# EAGLE design RFM2Pi_rev3 (EAGLE 6.2)
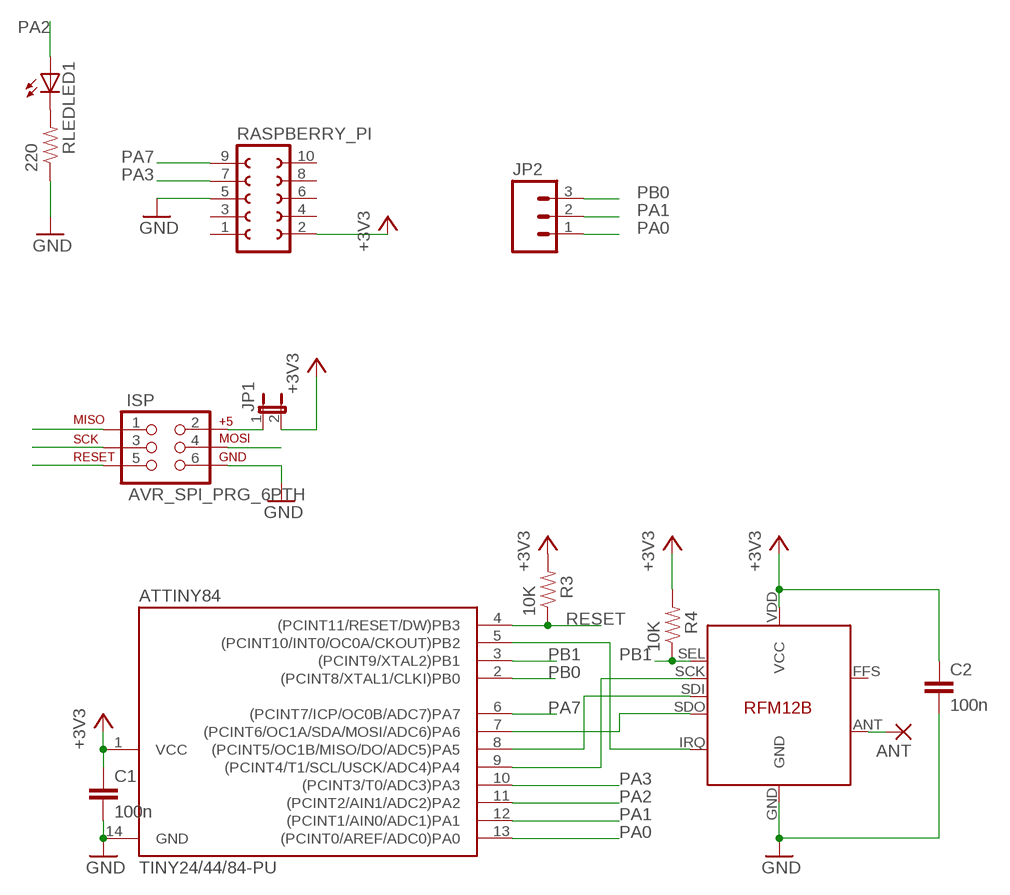
[diagram p0: schematic, sheet 1]

## Parts
ANT  1,6/0,8  [1,6/0,8]
ATTINY84  TINY24/44/84-PU  [DIL14]
C1  100n  C-EU025-024X044  [C025-024X044]
C2  100n  C-EU025-024X044  [C025-024X044]
ISP  AVR_SPI_PRG_6PTH  [2X3]
JP1  JUMPER-2PTH  [1X02]
JP2  M03LOCK  [1X03_LOCK]
LED1  LED5MM  [LED5MM]
R3  10K  RESISTORAXIAL-0.3  [AXIAL-0.3]
R4  10K  RESISTORAXIAL-0.3  [AXIAL-0.3]
RASPBERRY_PI  FE05-2  [FE05-2]
RFM12B  RFM12B  [RFM12B]
RLED  220  RESISTORAXIAL-0.3  [AXIAL-0.3]

## Nets
+3V3 [power]: ATTINY84.1(VCC) C1.1 C2.1 JP1.2 R3.P$2 R4.P$2 RASPBERRY_PI.2 RFM12B.VDD(VCC)
GND [power]: ATTINY84.14(GND) C1.2 C2.2 ISP.6 RASPBERRY_PI.5 RFM12B.GND RLED.P$1
MISO: ATTINY84.8((PCINT5/OC1B/MISO/DO/ADC5)PA5) ISP.1 RFM12B.SDI
MOSI: ATTINY84.7((PCINT6/OC1A/SDA/MOSI/ADC6)PA6) ISP.4 RFM12B.SDO
N$1: ISP.2 JP1.1
N$3: LED1.K(C) RLED.P$2
N$6 [power]: ANT.1(P) RFM12B.ANT
PA0: ATTINY84.13((PCINT0/AREF/ADC0)PA0) JP2.1
PA1 [power]: ATTINY84.12((PCINT1/AIN0/ADC1)PA1) JP2.2
PA2: ATTINY84.11((PCINT2/AIN1/ADC2)PA2) LED1.A
PA3: ATTINY84.10((PCINT3/T0/ADC3)PA3) RASPBERRY_PI.7
PA7: ATTINY84.6((PCINT7/ICP/OC0B/ADC7)PA7) RASPBERRY_PI.9
PB0: ATTINY84.2((PCINT8/XTAL1/CLKI)PB0) JP2.3
PB1: ATTINY84.3((PCINT9/XTAL2)PB1) R4.P$1 RFM12B.SEL
PB2: ATTINY84.5((PCINT10/INT0/OC0A/CKOUT)PB2) RFM12B.IRQ
RESET: ATTINY84.4((PCINT11/RESET/DW)PB3) ISP.5 R3.P$1
SCK: ATTINY84.9((PCINT4/T1/SCL/USCK/ADC4)PA4) ISP.3 RFM12B.SCK
Unconnected: RASPBERRY_PI.1 RASPBERRY_PI.3 RASPBERRY_PI.4 RASPBERRY_PI.6 RASPBERRY_PI.8 RASPBERRY_PI.10 RFM12B.FFS

## Library data of the parts
ANT = JeeLabs:1,6/0,8: THROUGH-HOLE PAD
ATTINY84 = avr-7:TINY24/44/84
C1 C2 = rcl:C-EU: CAPACITOR, European symbol
ISP = SparkFun:AVR_SPI_PRG_6: AVR ISP 6 Pin This is the reduced ISP connector for AVR programming. Common on Arduino. This footprint will take up less PCB space and can be used with a 10-pin to 6-pin adapter such as SKU: BOB-08508
JP1 = SparkFun:JUMPER-2: Jumper Basic 0.1" spaced jumper. Use with breakaway headers.
JP2 = SparkFun:M03: Header 3 Standard 3-pin 0.1" header. Use with straight break away headers (SKU : PRT-00116), right angle break away headers (PRT-00553), swiss pins (PRT-00743), machine pins (PRT-00117), and female headers (PRT-00115). Molex polarized connector foot print use with SKU : PRT-08232 with associated crimp pins and housings.
LED1 = led:LED: LED OSRAM: - CHIPLED LG R971, LG N971, LY N971, LG Q971, LY Q971, LO R971, LY R971 LH N974, LH R974 LS Q976, LO Q976, LY Q976 LO Q996 - Hyper CHIPLED LW Q18S LB Q993, LB Q99A, LB R99A - SideLED LS A670, LO A670, LY A670, LG A670, LP A670 LB A673, LV A673, LT A673, LW A673 LH A674 LY A675 LS A676, LA A676, LO A676, LY A676, LW A676 LS A679, LY A679, LG A679 - Hyper Micro SIDELED® LS Y876, LA Y876, LO Y876, LY Y876 LT Y87S - SmartLED LW L88C, LW L88S LB L89C, LB L89S, LG L890 LS L89K, LO L89K, LY L89K LS L896, LA L896, LO L896, LY L896 - TOPLED LS T670, LO T670, LY T670, LG T670, LP T670 LSG T670, LSP T670, LSY T670, LOP T670, LYG T670 LG T671, LOG T671, LSG T671 LB T673, LV T673, LT T673, LW T673 LH T674 LS T676, LA T676, LO T676, LY T676, LB T676, LH T676, LSB T676, LW T676 LB T67C, LV T67C, LT T67C, LS T67K, LO T67K, LY T67K, LW E67C LS E67B, LA E67B, LO E67B, LY E67B, LB E67C, LV E67C, LT E67C LW T67C LS T679, LY T679, LG T679 LS T770, LO T770, LY T770, LG T770, LP T770 LB T773, LV T773, LT T773, LW T773 LH T774 LS E675, LA E675, LY E675, LS T675 LS T776, LA T776, LO T776, LY T776, LB T776 LHGB T686 LT T68C, LB T68C - Hyper Mini TOPLED® LB M676 - Mini TOPLED Santana® LG M470 LS M47K, LO M47K, LY M47K Source: http://www.osram.convergy.de LUXEON: - LUMILED® LXK2-PW12-R00, LXK2-PW12-S00, LXK2-PW14-U00, LXK2-PW14-V00 LXK2-PM12-R00, LXK2-PM12-S00, LXK2-PM14-U00 LXK2-PE12-Q00, LXK2-PE12-R00, LXK2-PE12-S00, LXK2-PE14-T00, LXK2-PE14-U00 LXK2-PB12-K00, LXK2-PB12-L00, LXK2-PB12-M00, LXK2-PB14-N00, LXK2-PB14-P00, LXK2-PB14-Q00 LXK2-PR12-L00, LXK2-PR12-M00, LXK2-PR14-Q00, LXK2-PR14-R00 LXK2-PD12-Q00, LXK2-PD12-R00, LXK2-PD12-S00 LXK2-PH12-R00, LXK2-PH12-S00 LXK2-PL12-P00, LXK2-PL12-Q00, LXK2-PL12-R00 Source: www.luxeon.com KINGBRIGHT: KA-3528ASYC Source: www.kingbright.com
R3 R4 RLED = SparkFun:RESISTOR: Resistor Basic schematic elements and footprints for 0603, 1206, and PTH resistors.
RASPBERRY_PI = con-lsta:FE05-2: FEMALE HEADER; OC_FARNELL: unknown; OC_NEWARK: unknown
RFM12B = JeeLabs:RFM12B

## Net classes
0 default: width 0.254 mm, drill 0.254 mm, clearance 0.254 mm
1 power: width 0.305 mm, drill 0.305 mm, clearance 0.305 mm

## Board
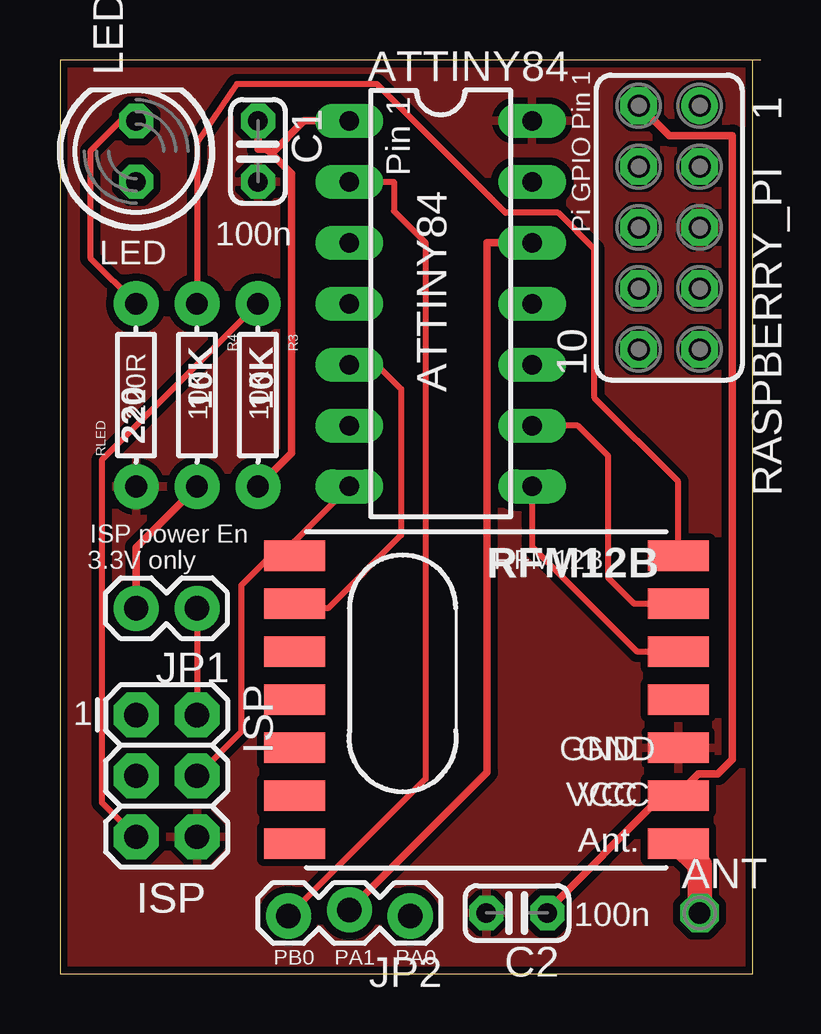
[diagram p1: board, top side]
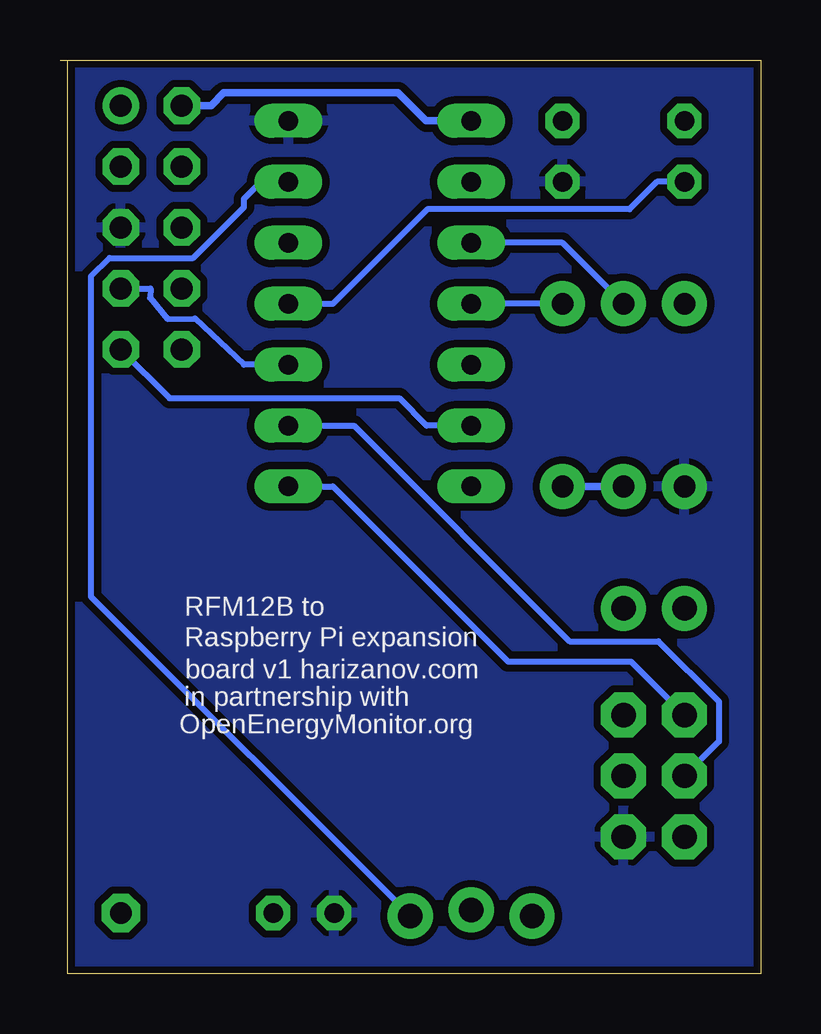
[diagram p2: board, bottom side, seen from below]

Size 29.21 x 38.1 mm. Coordinates in mm from the lower left corner, seen from the top.
Outline: 28.88,38.09 28.88,0 0,0 0,38.1 29.21,38.1
Copper layers (1*16): Top 0.035mm / dielectric 1.5mm / Bottom 0.035mm
Design rules: minimum track width 12mil, minimum drill 24mil, track to track 12mil, track to pad 12mil, pad to pad 12mil, via to via 14mil, smd to smd 10mil, copper to edge 12mil, drill to drill 8mil, minimum pad ring 12mil, minimum via ring 8mil, stop-mask expansion 4mil, vias tented up to drill 0mil, thermal gap 10mil

### Footprints (pad centres in the part's own frame; a part is rotated, then mirrored left to right if it is on the bottom)
1,6/0,8 = drill 0.9 pad 1.6 octagon: 1 0,0
DIL14 = drill 0.813 long: 1 -7.62,-3.81; 2 -5.08,-3.81; 3 -2.54,-3.81; 4 0,-3.81; 5 2.54,-3.81; 6 5.08,-3.81; 7 7.62,-3.81; 8 7.62,3.81; 9 5.08,3.81; 10 2.54,3.81; 11 0,3.81; 12 -2.54,3.81; 13 -5.08,3.81; 14 -7.62,3.81
C025-024X044 = drill 0.813 octagon: 1 -1.27,0; 2 1.27,0
2X3 = drill 1.016 pad 1.88 octagon: 1 0,0; 2 0,2.54; 3 2.54,0; 4 2.54,2.54; 5 5.08,0; 6 5.08,2.54
1X02 = drill 1.016 pad 1.88: 1 0,0; 2 2.54,0
1X03_LOCK = drill 1.016 pad 1.88: 1 0,0.127; 2 2.54,-0.127; 3 5.08,0.127
LED5MM = drill 0.813 octagon: A -1.27,0; K 1.27,0
AXIAL-0.3 = drill 0.9 pad 1.88: P$1 -3.81,0; P$2 3.81,0
FE05-2 = drill 0.914: 1 -5.08,1.27 | drill 0.914 octagon: 2 -5.08,-1.27; 3 -2.54,1.27; 4 -2.54,-1.27; 5 0,1.27; 6 0,-1.27; 7 2.54,1.27; 8 2.54,-1.27; 9 5.08,1.27; 10 5.08,-1.27
RFM12B = smd 2.54 x 1.27: ANT 8,-6; FFS -8,2; GND 8,-2; IRQ -8,4; P$8 -8,0; P$9 -8,-2; P$10 -8,-4; P$12 -8,-6; P$16 8,0; SCK 8,4; SDI 8,2; SDO -8,6; SEL 8,6; VDD 8,-4

### Placement (x,y rotation side)
ANT  26.67,2.54 0 top
ATTINY84  15.88,27.94 270 top
C1  8.26,34.29 270 top
C2  19.05,2.54 180 top
ISP  3.17,10.79 270 top
JP1  5.71,15.24 180 top
JP2  14.61,2.54 180 top
LED1  3.17,34.29 90 top
R3  8.26,24.13 270 top
R4  5.71,24.13 270 top
RASPBERRY_PI  25.4,31.11 270 top
RFM12B  17.78,11.43 0 top
RLED  3.17,24.13 90 top

### Tracks (layer width: path | path; a pad name or v marks a point on that pad's centre or on a via)
+3V3
  Top 0.305: 8.82,34.19 8.62,34.39 8.26,34.39 C1.1 | R3.P$2 9.65,21.72 9.65,33.35 8.82,34.19 | 8.82,34.19 10.19,35.56 ATTINY84.1 | R4.P$2 3.17,17.78 JP1.2 | C2.1 20.32,2.64 24.99,7.32 25.6,7.32 RFM12B.VDD 25.81,7.52 26.62,8.33 27.43,8.33 28.04,8.94 28.04,34.95 25.4,34.95 24.18,36.17 RASPBERRY_PI.2
  Bottom 0.305: ATTINY84.1 13.95,35.56 15.11,36.73 22.38,36.73 22.91,36.2 RASPBERRY_PI.2 | R4.P$2 R3.P$2
GND
  pour Bottom: 30.48,-1.27 -1.27,-1.27 -1.27,38.1 30.48,38.1
  pour Top: 31.75,-2.54 -2.54,-2.54 -2.54,39.37 31.75,39.37
MISO
  Top 0.254: RFM12B.SDI 24.08,13.43 19.68,17.82 ATTINY84.8
  Bottom 0.254: ATTINY84.8 17.83,20.32 10.53,13.02 5.4,13.02 ISP.1
MOSI
  Top 0.254: ISP.4 7.57,10.11 7.57,16.21 8.64,17.27 9.62,17.27 RFM12B.SDO 9.78,18.04 ATTINY84.7
N$1
  Top 0.254: JP1.1 ISP.2
N$3
  Top 0.254: LED1.K 2.54,35.56 1.27,34.29 1.27,29.84 RLED.P$2
N$6
  Top 1.016: ANT.1 26.67,4.54 RFM12B.ANT
PA0
  Bottom 0.254: JP2.1 27.91,15.72 27.91,29.08 27.15,29.84 23.66,29.84 21.54,31.96 21.54,32.31 20.83,33.02 ATTINY84.13
PA1
  Top 0.305: ATTINY84.12 17.8,30.48 17.8,8.41 JP2.2
PA2
  Bottom 0.254: ATTINY84.11 17.83,27.94 13.89,31.88 5.46,31.88 4.32,33.02 LED1.A
PA3
  Bottom 0.254: ATTINY84.10 21.54,25.4 23.58,27.32 24.72,27.31 25.46,28.19 25.43,28.57 RASPBERRY_PI.7
PA7
  Bottom 0.254: ATTINY84.6 13.92,22.86 15.06,24 24.64,24 RASPBERRY_PI.9
PB0
  Top 0.254: ATTINY84.2 13.92,33.02 13.92,31.8 15.24,30.48 15.24,8.13 JP2.3
PB1
  Top 0.254: RFM12B.SEL 25.78,20.52 22.29,24.01 22.29,30.21 20.77,31.73 18.58,31.73 13.21,37.09 7.37,37.09 5.71,34.67 R4.P$1
  Bottom 0.254: R4.P$1 8.26,30.48 ATTINY84.3
PB2
  Top 0.254: ATTINY84.5 13.21,25.4 14.22,24.38 14.22,18.29 11.18,15.24 9.97,15.24 RFM12B.IRQ
RESET
  Top 0.254: R3.P$1 1.74,21.43 1.74,7.15 ISP.5
  Bottom 0.254: R3.P$1 ATTINY84.4
SCK
  Top 0.254: RFM12B.SCK 23.94,15.43 22.86,16.51 22.86,21.59 21.59,22.86 ATTINY84.9
  Bottom 0.254: ATTINY84.9 16.95,22.86 7.96,13.87 4.25,13.87 1.74,11.36 1.74,9.69 ISP.3

### Text on the board
_tsilk: Pi GPIO Pin 1 | Pin 1 | LED | 100n | 10K | 10K | ATTINY84 | 220R | ISP power En | 3.3V only | RFM12B | 1 | GND | VCC | Ant. | ISP | ISP | 100n | PB0 | PA1 | PA0
_bsilk: RFM12B to | Raspberry Pi expansion | board v1 harizanov.com | in partnership with | OpenEnergyMonitor.org